# EAGLE design TinyGController (EAGLE 6.6.0)

## Sheet 1 of 3
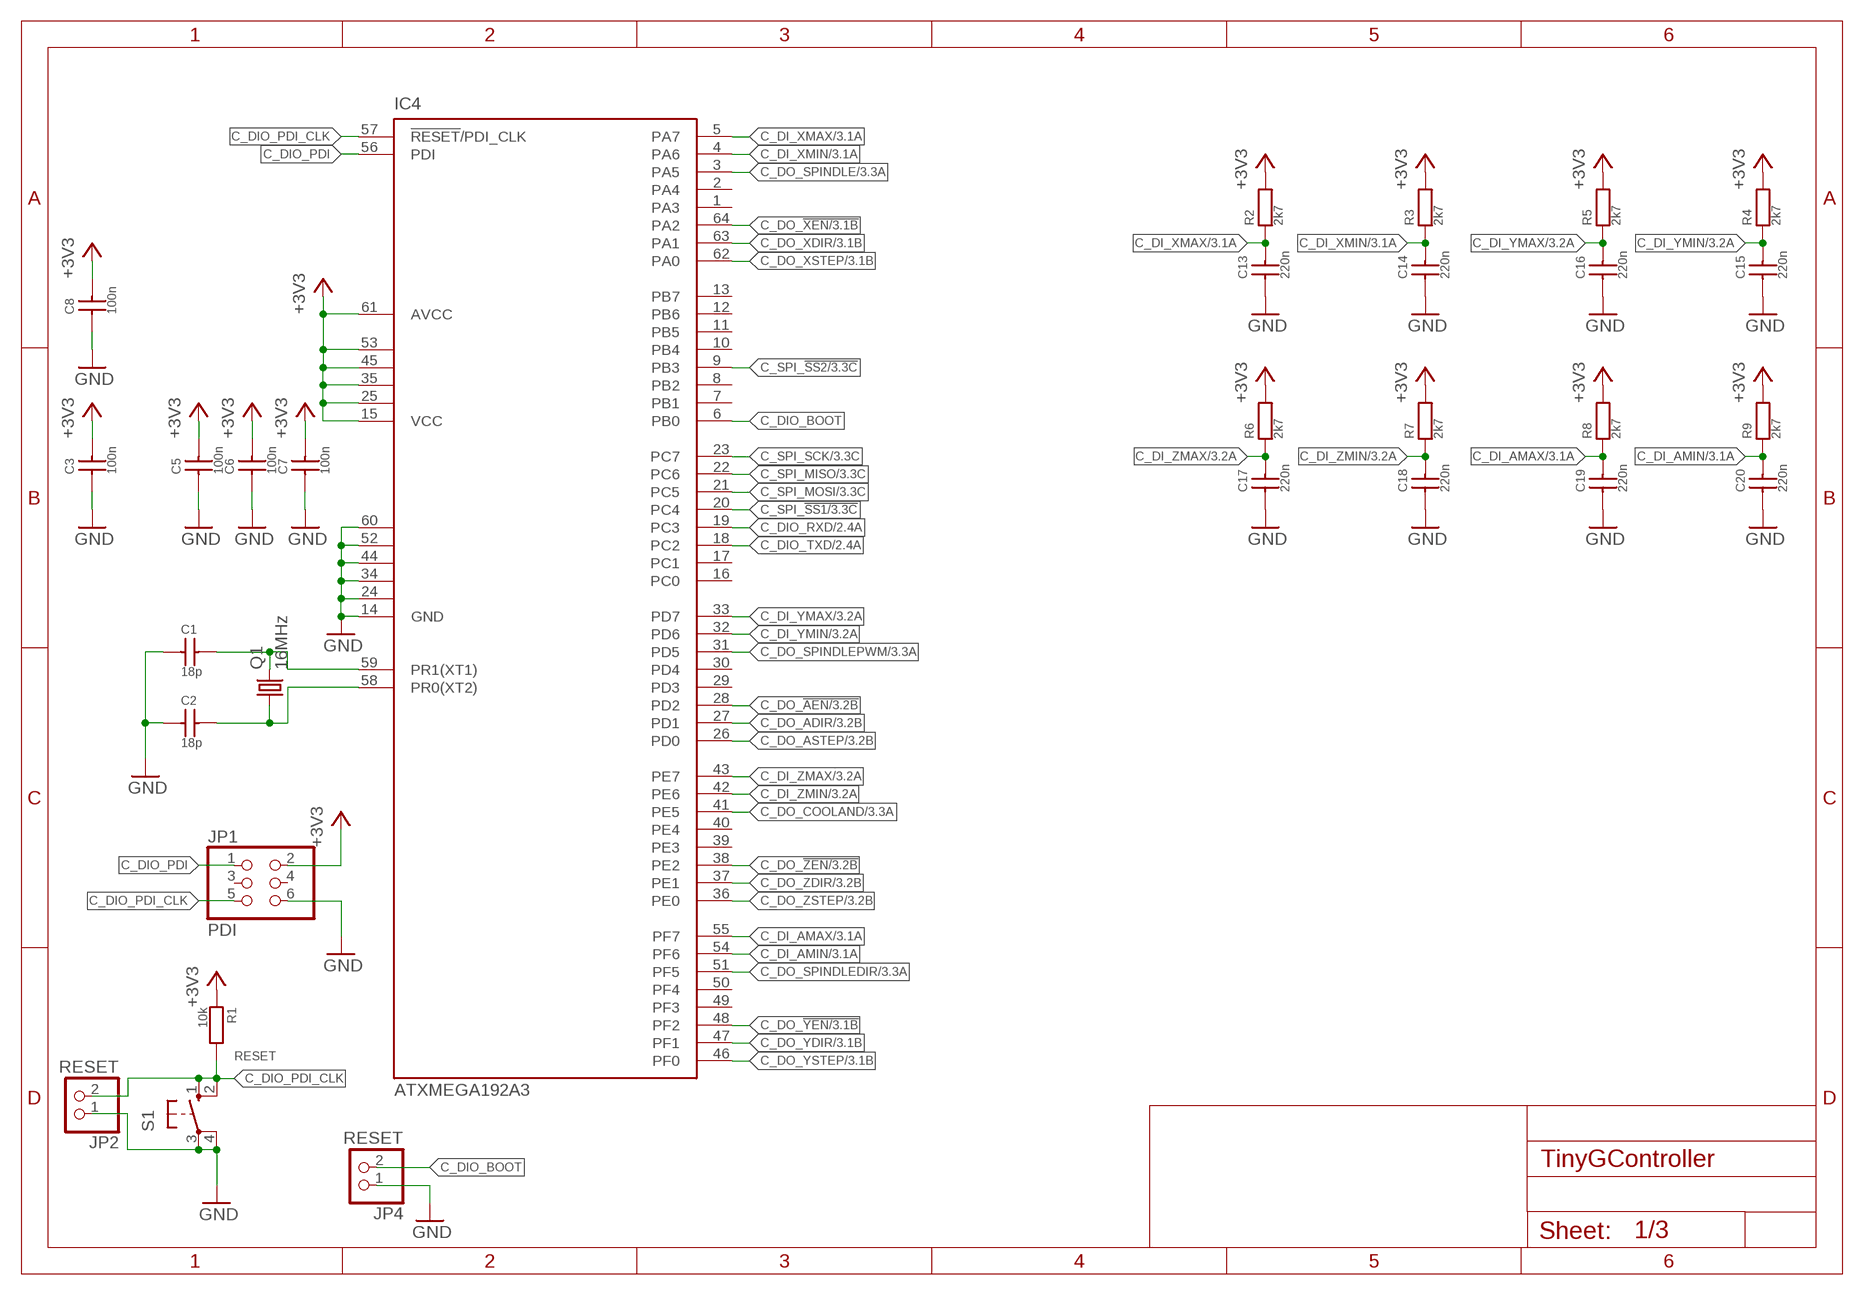
[diagram p0: schematic, sheet 1]

### Parts
C1  18p  C_SMD0603  [C0603]
C2  18p  C_SMD0603  [C0603]
C3  100n  C_SMD0603  [C0603]
C5  100n  C_SMD0603  [C0603]
C6  100n  C_SMD0603  [C0603]
C7  100n  C_SMD0603  [C0603]
C8  100n  C_SMD0603  [C0603]
C13  220n  C_SMD0805  [C0805]
C14  220n  C_SMD0805  [C0805]
C15  220n  C_SMD0805  [C0805]
C16  220n  C_SMD0805  [C0805]
C17  220n  C_SMD0805  [C0805]
C18  220n  C_SMD0805  [C0805]
C19  220n  C_SMD0805  [C0805]
C20  220n  C_SMD0805  [C0805]
IC4  ATXMEGA192A3  [TQFP64-0.8MM]
JP1  PDI  PINHD-2X3  [2X03]
JP2  RESET  PINHD-1X2  [1X02]
JP4  RESET  PINHD-1X2  [1X02]
Q1  16MHz  ATS073ASM-1  [HC49/USSM]
R1  10k  R0603  [R0603]
R2  2k7  R0603  [R0603]
R3  2k7  R0603  [R0603]
R4  2k7  R0603  [R0603]
R5  2k7  R0603  [R0603]
R6  2k7  R0603  [R0603]
R7  2k7  R0603  [R0603]
R8  2k7  R0603  [R0603]
R9  2k7  R0603  [R0603]
S1  10-XX  [B3F-10XX]

### Nets
+3V3: C3.2 C5.2 C6.2 C7.2 C8.2 IC4.15(VCC) IC4.25(VCC1) IC4.35(VCC2) IC4.45(VCC3) IC4.53(VCC4) IC4.61(AVCC) JP1.2 R1.1 R2.2 R3.2 R4.2 R5.2 R6.2 R7.2 R8.2 R9.2 ; also sheet 3
C_DI_AMAX: C19.2 IC4.55(PF7) R8.1 ; also sheet 3
C_DI_AMIN: C20.2 IC4.54(PF6) R9.1 ; also sheet 3
C_DI_XMAX: C13.2 IC4.5(PA7) R2.1 ; also sheet 3
C_DI_XMIN: C14.2 IC4.4(PA6) R3.1 ; also sheet 3
C_DI_YMAX: C16.2 IC4.33(PD7) R5.1 ; also sheet 3
C_DI_YMIN: C15.2 IC4.32(PD6) R4.1 ; also sheet 3
C_DI_ZMAX: C17.2 IC4.43(PE7) R6.1 ; also sheet 3
C_DI_ZMIN: C18.2 IC4.42(PE6) R7.1 ; also sheet 3
C_DIO_BOOT: IC4.6(PB0) JP4.2
C_DIO_PDI: IC4.56(PDI) JP1.1
C_DIO_PDI_CLK: IC4.57(!RESET!/PDI_CLK) JP1.5 JP2.2 R1.2 S1.1(S) S1.2(S1)
C_DIO_RXD: IC4.19(PC3) ; also sheet 2
C_DIO_TXD: IC4.18(PC2) ; also sheet 2
C_DO_!AEN: IC4.28(PD2) ; also sheet 3
C_DO_!XEN: IC4.64(PA2) ; also sheet 3
C_DO_!YEN: IC4.48(PF2) ; also sheet 3
C_DO_!ZEN: IC4.38(PE2) ; also sheet 3
C_DO_ADIR: IC4.27(PD1) ; also sheet 3
C_DO_ASTEP: IC4.26(PD0) ; also sheet 3
C_DO_COOLAND: IC4.41(PE5) ; also sheet 3
C_DO_SPINDLE: IC4.3(PA5) ; also sheet 3
C_DO_SPINDLEDIR: IC4.51(PF5) ; also sheet 3
C_DO_SPINDLEPWM: IC4.31(PD5) ; also sheet 3
C_DO_XDIR: IC4.63(PA1) ; also sheet 3
C_DO_XSTEP: IC4.62(PA0) ; also sheet 3
C_DO_YDIR: IC4.47(PF1) ; also sheet 3
C_DO_YSTEP: IC4.46(PF0) ; also sheet 3
C_DO_ZDIR: IC4.37(PE1) ; also sheet 3
C_DO_ZSTEP: IC4.36(PE0) ; also sheet 3
C_SPI_!SS1: IC4.20(PC4) ; also sheet 3
C_SPI_!SS2: IC4.9(PB3) ; also sheet 3
C_SPI_MISO: IC4.22(PC6) ; also sheet 3
C_SPI_MOSI: IC4.21(PC5) ; also sheet 3
C_SPI_SCK: IC4.23(PC7) ; also sheet 3
GND: C1.1 C2.1 C3.1 C5.1 C6.1 C7.1 C8.1 C13.1 C14.1 C15.1 C16.1 C17.1 C18.1 C19.1 C20.1 IC4.14(GND) IC4.24(GND1) IC4.34(GND2) IC4.44(GND3) IC4.52(GND4) IC4.60(GND5) JP1.6 JP2.1 JP4.1 S1.3(P) S1.4(P1) ; also sheet 2,3
N$1: C1.2 IC4.59(PR1(XT1)) Q1.2
N$2: C2.2 IC4.58(PR0(XT2)) Q1.1
Unconnected: IC4.1(PA3) IC4.2(PA4) IC4.7(PB1) IC4.8(PB2) IC4.10(PB4) IC4.11(PB5) IC4.12(PB6) IC4.13(PB7) IC4.16(PC0) IC4.17(PC1) IC4.29(PD3) IC4.30(PD4) IC4.39(PE3) IC4.40(PE4) IC4.49(PF3) IC4.50(PF4) JP1.3 JP1.4

### Notes on the sheet
- RESET

## Sheet 2 of 3
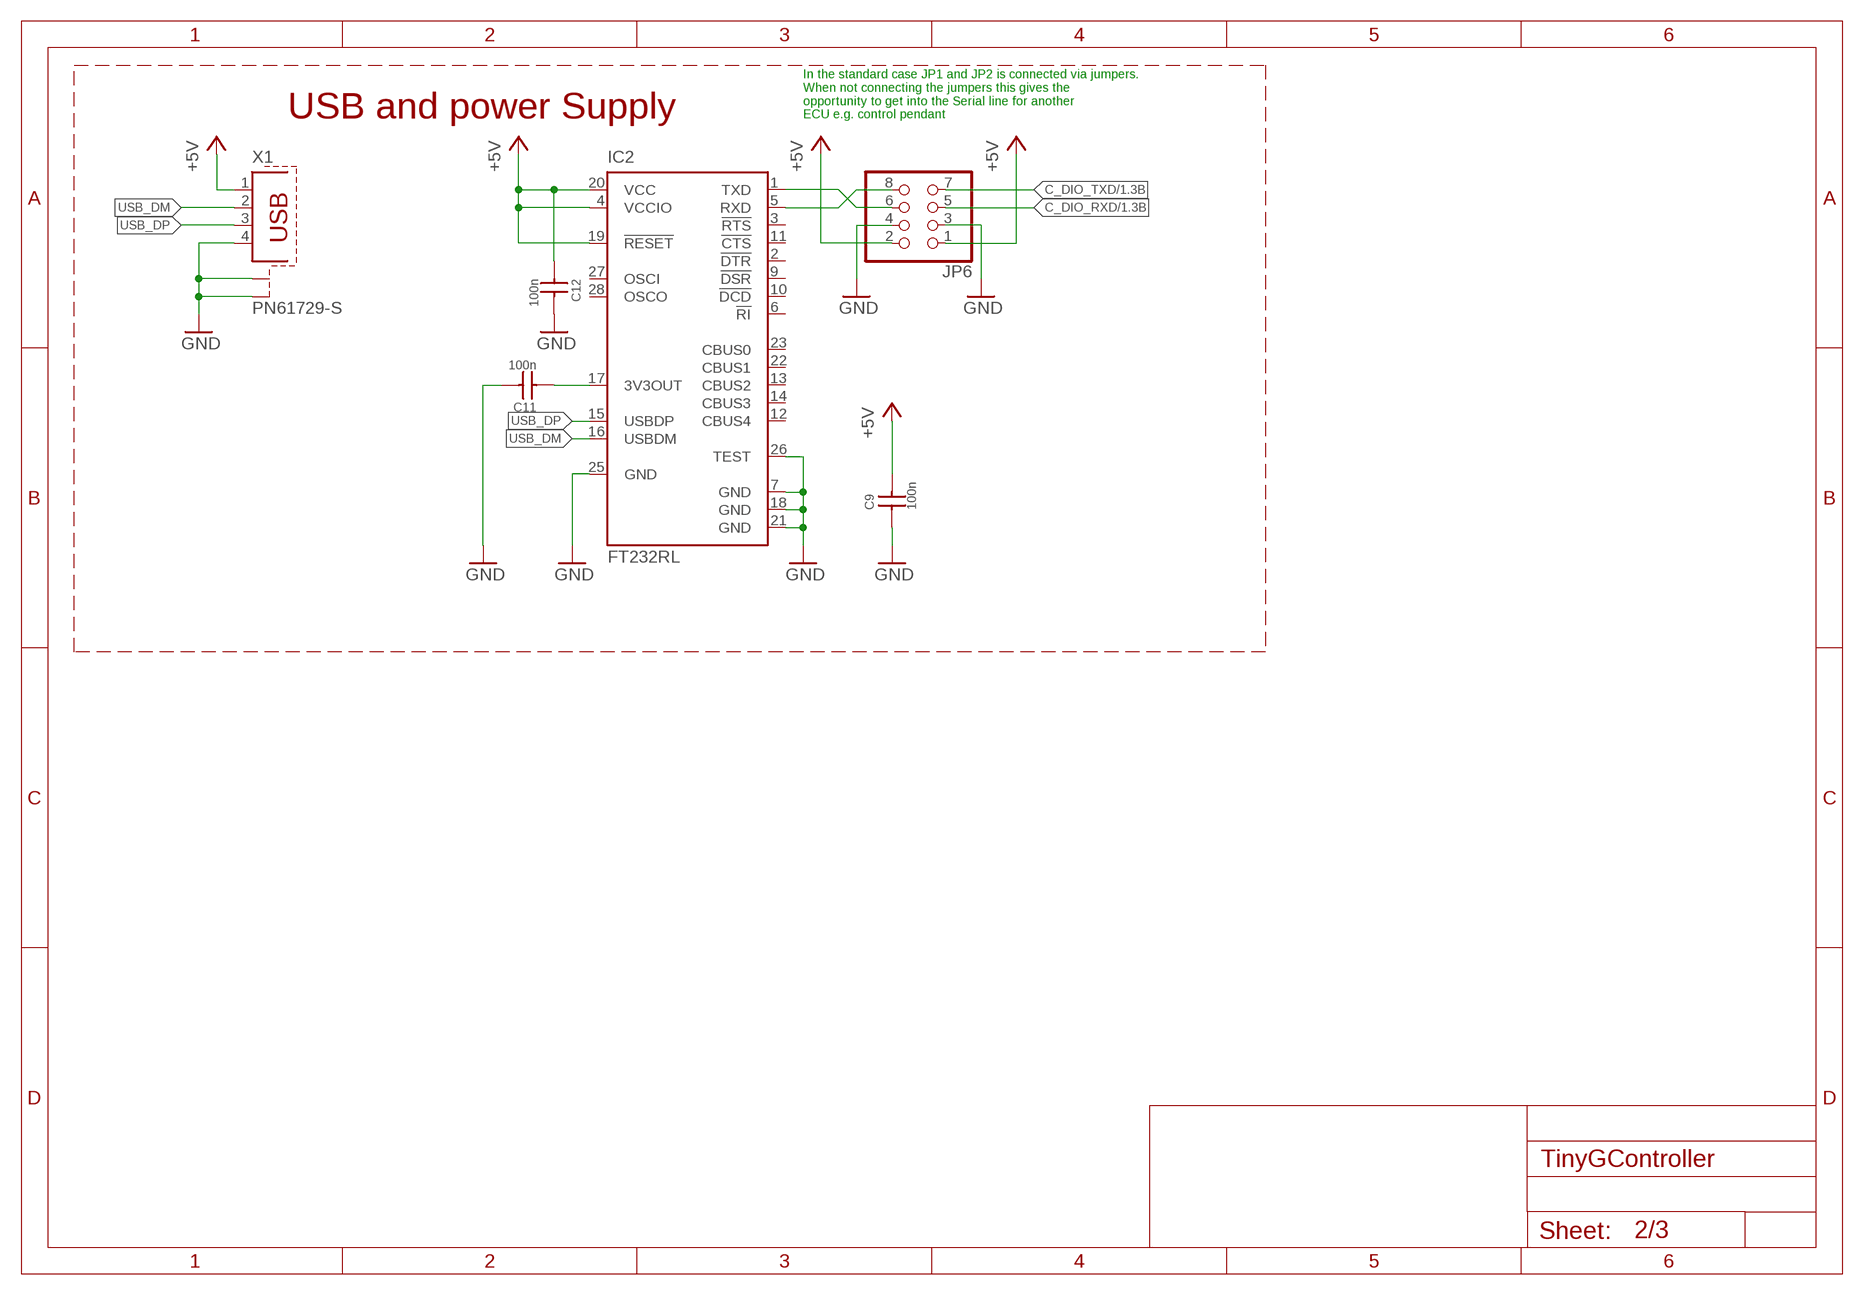
[diagram p1: schematic, sheet 2]

### Parts
C9  100n  C_SMD0603  [C0603]
C11  100n  C_SMD0603  [C0603]
C12  100n  C_SMD0603  [C0603]
IC2  FT232RL  [SSOP28]
JP6  PINHD-2X4  [2X04]
X1  PN61729-S  [PN61729-S]

### Nets
+5V: C9.2 C12.1 IC2.4(VCCIO) IC2.19(!RESET) IC2.20(VCC) JP6.1 JP6.2 X1.1
C_DIO_RXD: JP6.5 ; also sheet 1
C_DIO_TXD: JP6.7 ; also sheet 1
FTDI_3V3OUT: C11.1 IC2.17(3V3OUT)
GND: C9.1 C11.2 C12.2 IC2.7(GND) IC2.18(GND) IC2.21(GND) IC2.25(GND) IC2.26(TEST) JP6.3 JP6.4 X1.4 X1.S1 X1.S2 ; also sheet 1,3
N$5: IC2.1(TXD) JP6.6
N$7: IC2.5(RXD) JP6.8
USB_DM: IC2.16(USBDM) X1.2
USB_DP: IC2.15(USBDP) X1.3
Unconnected: IC2.2(!DTR) IC2.3(!RTS) IC2.6(!RI) IC2.9(!DSR) IC2.10(!DCD) IC2.11(!CTS) IC2.12(CBUS4) IC2.13(CBUS2) IC2.14(CBUS3) IC2.22(CBUS1) IC2.23(CBUS0) IC2.27(OSCI) IC2.28(OSCO)

### Notes on the sheet
- USB and power Supply
- In the standard case JP1 and JP2 is connected via jumpers.
  When not connecting the jumpers this gives the 
  opportunity to get into the Serial line for another 
  ECU e.g. control pendant

## Sheet 3 of 3
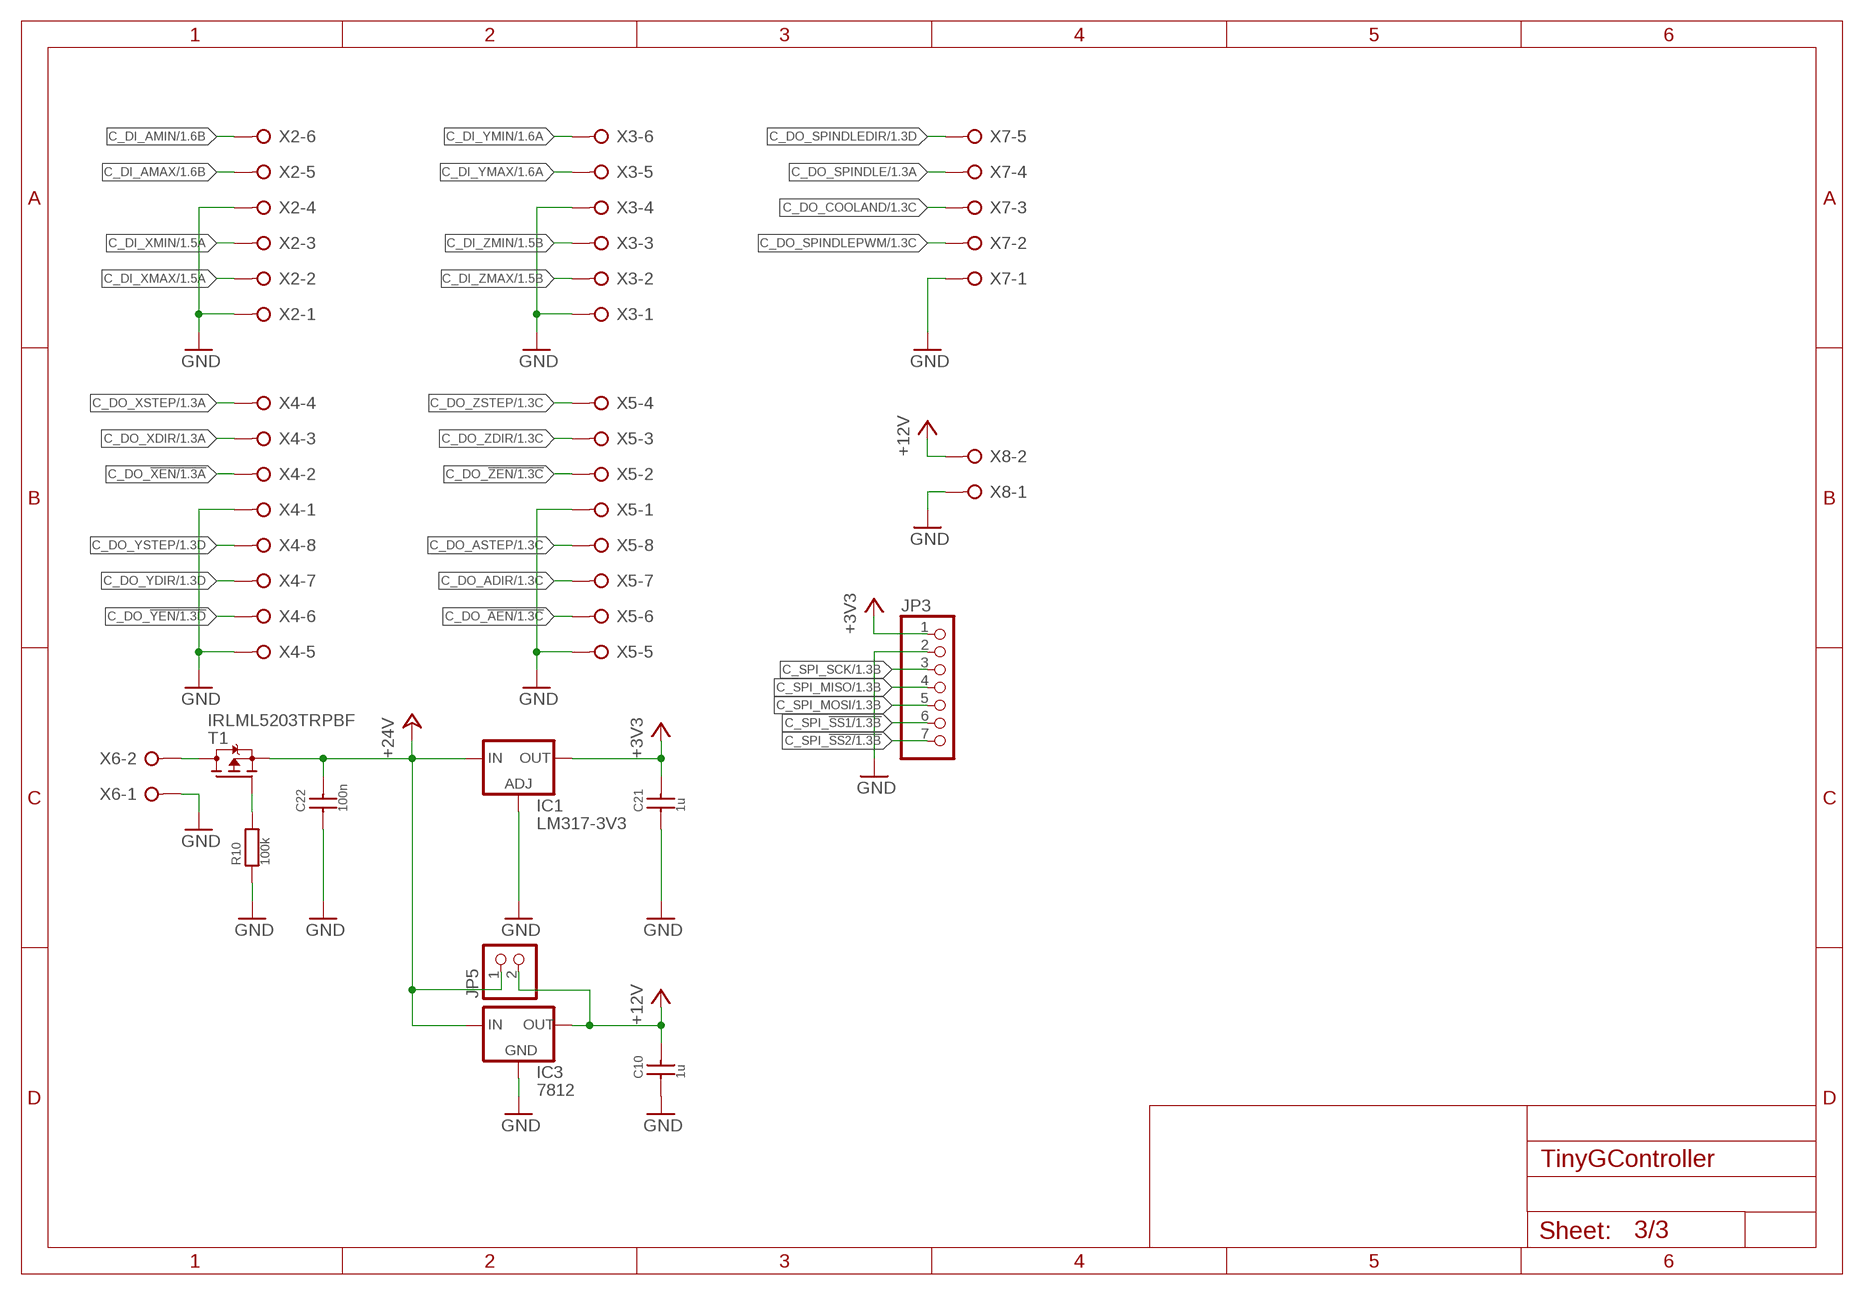
[diagram p2: schematic, sheet 3]

### Parts
C10  1u  C_SMD0805  [C0805]
C21  1u  C_SMD0805  [C0805]
C22  100n  C_SMD0805  [C0805]
IC1  LM317-3V3  LM317MBSTT3  [SOT223]
IC3  7812  78XXS  [78XXS]
JP3  PINHD-1X7  [1X07]
JP5  PINHD-1X2  [1X02]
R10  100k  R0603  [R0603]
T1  IRLML5203TRPBF  [SOT23]
X2  W237-06P  [W237-6P]
X3  W237-06P  [W237-6P]
X4  W237-08P  [W237-8P]
X5  W237-08P  [W237-8P]
X6  W237-02P  [W237-132]
X7  W237-05P  [W237-5P]
X8  W237-02P  [W237-132]

### Nets
+3V3: C21.2 IC1.4(OUT) JP3.1 ; also sheet 1
+12V: C10.2 IC3.OUT JP5.2 X8.2
+24V: C22.2 IC1.3(IN) IC3.IN JP5.1 T1.2(S)
C_DI_AMAX: X2.5 ; also sheet 1
C_DI_AMIN: X2.6 ; also sheet 1
C_DI_XMAX: X2.2 ; also sheet 1
C_DI_XMIN: X2.3 ; also sheet 1
C_DI_YMAX: X3.5 ; also sheet 1
C_DI_YMIN: X3.6 ; also sheet 1
C_DI_ZMAX: X3.2 ; also sheet 1
C_DI_ZMIN: X3.3 ; also sheet 1
C_DO_!AEN: X5.6 ; also sheet 1
C_DO_!XEN: X4.2 ; also sheet 1
C_DO_!YEN: X4.6 ; also sheet 1
C_DO_!ZEN: X5.2 ; also sheet 1
C_DO_ADIR: X5.7 ; also sheet 1
C_DO_ASTEP: X5.8 ; also sheet 1
C_DO_COOLAND: X7.3 ; also sheet 1
C_DO_SPINDLE: X7.4 ; also sheet 1
C_DO_SPINDLEDIR: X7.5 ; also sheet 1
C_DO_SPINDLEPWM: X7.2 ; also sheet 1
C_DO_XDIR: X4.3 ; also sheet 1
C_DO_XSTEP: X4.4 ; also sheet 1
C_DO_YDIR: X4.7 ; also sheet 1
C_DO_YSTEP: X4.8 ; also sheet 1
C_DO_ZDIR: X5.3 ; also sheet 1
C_DO_ZSTEP: X5.4 ; also sheet 1
C_SPI_!SS1: JP3.6 ; also sheet 1
C_SPI_!SS2: JP3.7 ; also sheet 1
C_SPI_MISO: JP3.4 ; also sheet 1
C_SPI_MOSI: JP3.5 ; also sheet 1
C_SPI_SCK: JP3.3 ; also sheet 1
GND: C10.1 C21.1 C22.1 IC1.1(ADJ) IC3.GND JP3.2 R10.1 X2.1 X2.4 X3.1 X3.4 X4.1 X4.5 X5.1 X5.5 X6.1 X7.1 X8.1 ; also sheet 1,2
N$3: R10.2 T1.1(G)
N$4: T1.3(D) X6.2

## Library data of the parts
C1-C3 C5-C22 = SchlegelAr_Master:C_SMD: C SMD 0402, 0603, 0805, 1206 last modified: Armin Schlegel, 24.03.2014
IC1 = v-reg:LM317?*: 500 mA Adjustable Output Positive Voltage Regulator Source: http://www.onsemi.co.jp .. LM317M-D.PDF
IC2 = SchlegelAr_Master:FT232RL: FT232RL - USB-IC-Schnittstelle USB to Serial UART Enhanced IC last modified: Armin Schlegel, 28.04.2014 http://de.mouser.com/ProductDetail/FTDI/FT232RL-REEL/?qs=sGAEpiMZZMs5ceO8zL%252bTxyQLQIH6hE7q http://www.mouser.com/ds/2/163/DS_FT232R-11534.pdf
IC3 = v-reg:78XXS: VOLTAGE REGULATOR
IC4 = SchlegelAr_Master:ATXMEGA192A3
JP1 = pinhead:PINHD-2X3: PIN HEADER
JP2 JP4 JP5 = pinhead:PINHD-1X2: PIN HEADER
JP3 = pinhead:PINHD-1X7: PIN HEADER
JP6 = pinhead:PINHD-2X4: PIN HEADER
Q1 = SchlegelAr_Master:ATS073ASM-1: ATS073ASM-1 - Quarze 7.3728MHz Series 30ppm -20C 70C last modified: Armin Schlegel, 21.03.2014 http://de.mouser.com/ProductDetail/CTS-Electronic-Components/ATS073ASM-1/?qs=sGAEpiMZZMsBj6bBr9Q9aSLORZG%2fS%2fcqT3YYbKWRivQ%3d http://www.mouser.com/ds/2/96/008-0309-0-32667.pdf
R1-R10 = SchlegelAr_Master:R: Widerstaende in 0402, 0603, 0805, 1206, 2512 last modified: Armin Schlegel, 28.04.2014
S1 = switch-omron:10-XX: OMRON SWITCH; MPN: B3F-1000; OC_FARNELL: 176432; OC_NEWARK: 36M3542
T1 = SchlegelAr_Master:IRLML5203TRPBF: IRLML5203TRPBF - MOSFET MOSFT P-Ch -30V -3A 98mOhm 9.5nC Log Lvl last modified: Armin Schlegel, 28.04.2014 http://de.mouser.com/ProductDetail/International-Rectifier/IRLML5203TRPBF/?qs=sGAEpiMZZMshyDBzk1%2fWi5%252bqVgN3%252bWS8t7qb9msI9Rk%3d http://www.mouser.com/ds/2/200/irlml5203pbf-223113.pdf
X1 = con-berg:PN61729-S: BERG USB connector; OC_FARNELL: unknown; OC_NEWARK: unknown
X2 X3 = con-wago-508:W237-06P: WAGO SREW CLAMP; OC_FARNELL: unknown; OC_NEWARK: unknown
X4 X5 = con-wago-508:W237-08P: WAGO SREW CLAMP; OC_FARNELL: unknown; OC_NEWARK: unknown
X6 X8 = con-wago-508:W237-02P: WAGO SREW CLAMP; OC_FARNELL: unknown; OC_NEWARK: unknown
X7 = con-wago-508:W237-05P: WAGO SREW CLAMP; OC_FARNELL: unknown; OC_NEWARK: unknown

## Board
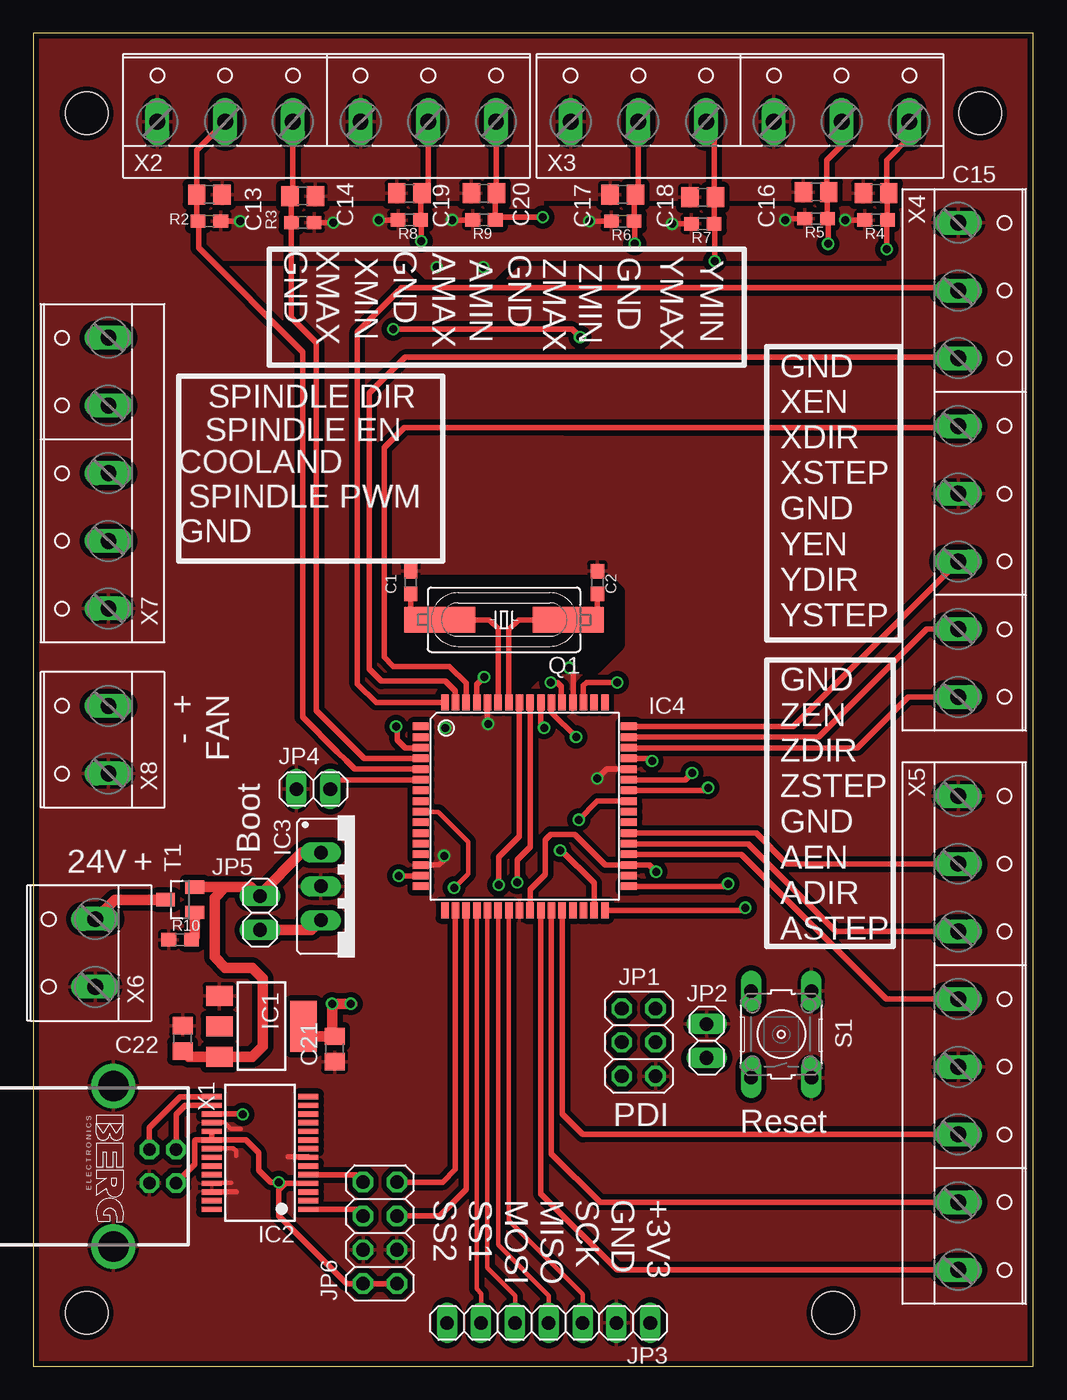
[diagram p3: board, top side]
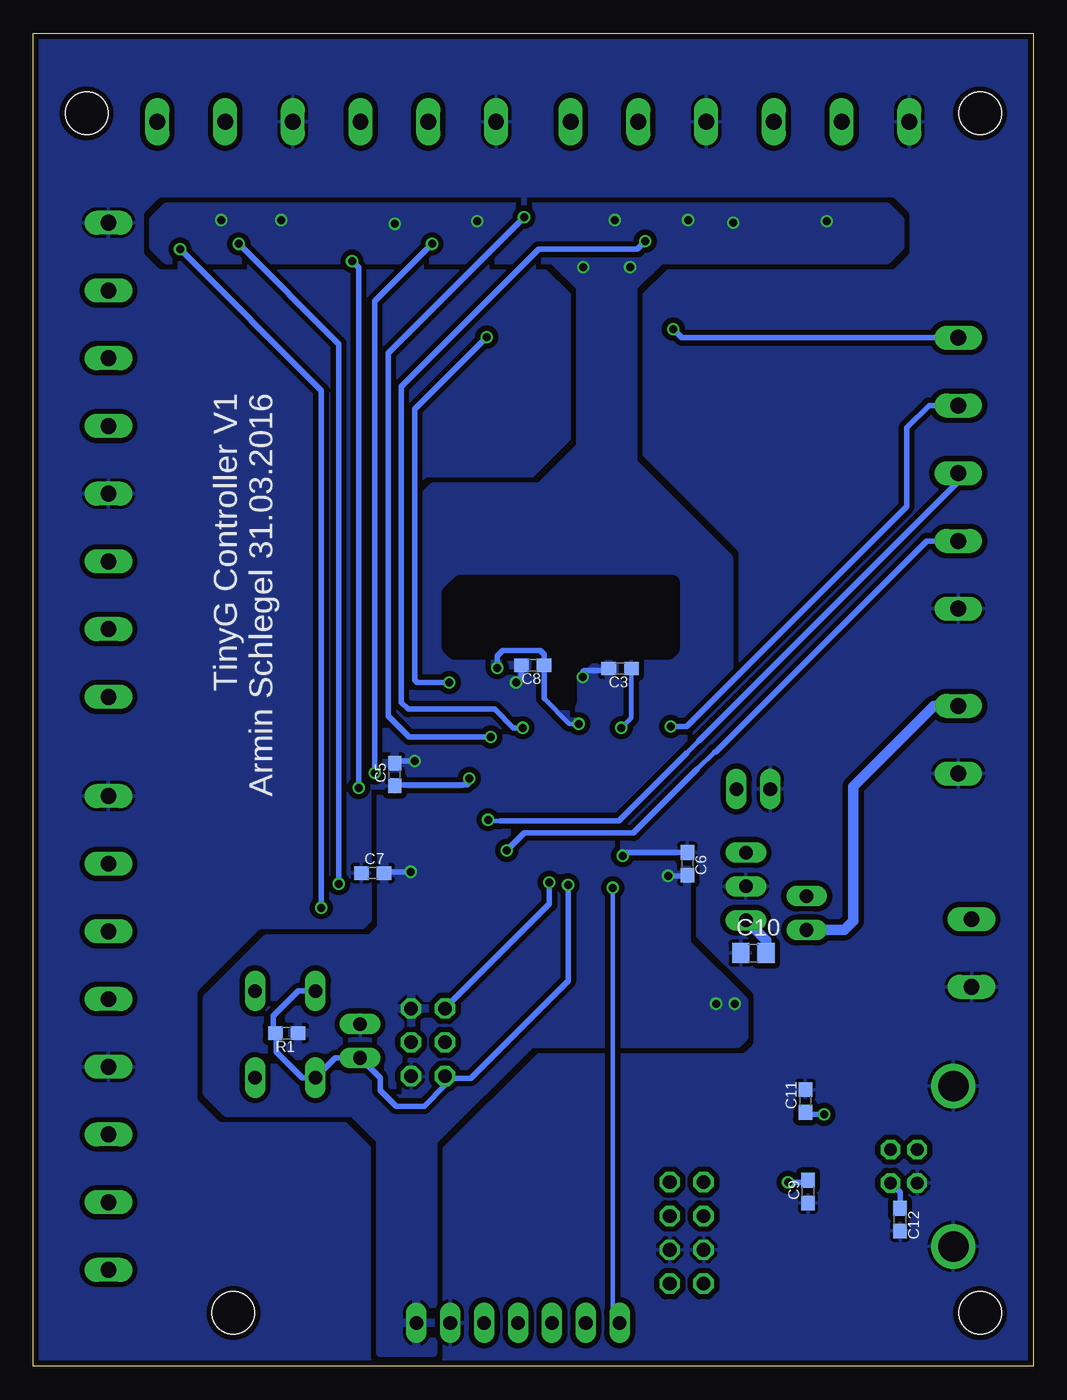
[diagram p4: board, bottom side, seen from below]

Size 75 x 100 mm. Coordinates in mm from the lower left corner, seen from the top.
Outline: 0,0 75,0 75,100 0,100 0,0
Copper layers (1*16): Top 0.035mm / dielectric 1.5mm / Bottom 0.035mm
Design rules "Elecrow_2-layer_eagle_rule": minimum track width 6mil, minimum drill 12mil, track to track 6mil, track to pad 6mil, pad to pad 6mil, via to via 6mil, smd to smd 0mil, copper to edge 10mil, drill to drill 10mil, minimum pad ring 10mil, minimum via ring 6mil, stop-mask expansion 2mil, vias tented up to drill 100mil, thermal gap 10mil
Holes 3.2 mm at 4,94 71,94 4,4 60,4
tRestrict: area 27.1,50.8 to 43.8,58.8
bRestrict: area 27.1,49.8 to 43.8,58.8

### Footprints (pad centres in the part's own frame; a part is rotated, then mirrored left to right if it is on the bottom)
C0603 = smd 1.1 x 1: 1 -0.85,0; 2 0.85,0
C0805 = smd 1.3 x 1.5: 1 -0.95,0; 2 0.95,0
SOT223 = smd 1.5 x 2: 1 -2.3,-3.15; 2 0,-3.15; 3 2.3,-3.15 | smd 3.8 x 2: 4 0,3.15
SSOP28 = smd 0.4 x 1.5: 1 -4.225,-3.625; 2 -3.575,-3.625; 3 -2.925,-3.625; 4 -2.275,-3.625; 5 -1.625,-3.625; 6 -0.975,-3.625; 7 -0.325,-3.625; 8 0.325,-3.625; 9 0.975,-3.625; 10 1.625,-3.625; 11 2.275,-3.625; 12 2.925,-3.625; 13 3.575,-3.625; 14 4.225,-3.625; 15 4.225,3.625; 16 3.575,3.625; 17 2.925,3.625; 18 2.275,3.625; 19 1.625,3.625; 20 0.975,3.625; 21 0.325,3.625; 22 -0.325,3.625; 23 -0.975,3.625; 24 -1.625,3.625; 25 -2.275,3.625; 26 -2.925,3.625; 27 -3.575,3.625; 28 -4.225,3.625
78XXS = drill 1.016 long: GND 0,-2.54; IN -2.54,-2.54; OUT 2.54,-2.54
TQFP64-0.8MM = smd 1.194 x 0.559: 1 -7.94,6; 2 -7.94,5.2; 3 -7.94,4.4; 4 -7.94,3.6; 5 -7.94,2.8; 6 -7.94,2; 7 -7.94,1.2; 8 -7.94,0.4; 9 -7.94,-0.4; 10 -7.94,-1.2; 11 -7.94,-2; 12 -7.94,-2.8; 13 -7.94,-3.6; 14 -7.94,-4.4; 15 -7.94,-5.2; 16 -7.94,-6; 33 7.66,-6; 34 7.66,-5.2; 35 7.66,-4.4; 36 7.66,-3.6; 37 7.66,-2.8; 38 7.66,-2; 39 7.66,-1.2; 40 7.66,-0.4; 41 7.66,0.4; 42 7.66,1.2; 43 7.66,2; 44 7.66,2.8; 45 7.66,3.6; 46 7.66,4.4; 47 7.66,5.2; 48 7.66,6 | smd 0.559 x 1.194: 17 -6.14,-7.8; 18 -5.34,-7.8; 19 -4.54,-7.8; 20 -3.74,-7.8; 21 -2.94,-7.8; 22 -2.14,-7.8; 23 -1.34,-7.8; 24 -0.54,-7.8; 25 0.26,-7.8; 26 1.06,-7.8; 27 1.86,-7.8; 28 2.66,-7.8; 29 3.46,-7.8; 30 4.26,-7.8; 31 5.06,-7.8; 32 5.86,-7.8; 49 5.86,7.8; 50 5.06,7.8; 51 4.26,7.8; 52 3.46,7.8; 53 2.66,7.8; 54 1.86,7.8; 55 1.06,7.8; 56 0.26,7.8; 57 -0.54,7.8; 58 -1.34,7.8; 59 -2.14,7.8; 60 -2.94,7.8; 61 -3.74,7.8; 62 -4.54,7.8; 63 -5.34,7.8; 64 -6.14,7.8
2X03 = drill 1.016 octagon: 1 -2.54,-1.27; 2 -2.54,1.27; 3 0,-1.27; 4 0,1.27; 5 2.54,-1.27; 6 2.54,1.27
1X02 = drill 1.016 long: 1 -1.27,0; 2 1.27,0
1X07 = drill 1.016 long: 1 -7.62,0; 2 -5.08,0; 3 -2.54,0; 4 0,0; 5 2.54,0; 6 5.08,0; 7 7.62,0
2X04 = drill 1.016 octagon: 1 -3.81,-1.27; 2 -3.81,1.27; 3 -1.27,-1.27; 4 -1.27,1.27; 5 1.27,-1.27; 6 1.27,1.27; 7 3.81,-1.27; 8 3.81,1.27
HC49/USSM = smd 5.334 x 1.93: 1 -4.826,0; 2 4.826,0
R0603 = smd 1.1 x 1: 1 -0.85,0; 2 0.85,0
B3F-10XX = drill 1.016 long: 1 -3.251,2.261; 2 3.251,2.261; 3 -3.251,-2.261; 4 3.251,-2.261
SOT23 = smd 1 x 1.4: 1 -0.95,-1.1; 2 0.95,-1.1; 3 0,1.1
PN61729-S = drill 0.95 octagon: 1 1.25,4.71; 2 -1.25,4.71; 3 -1.25,2.71; 4 1.25,2.71 | drill 2.3 pad 2.9: S1 -6.02,0; S2 6.02,0
W237-6P = drill 1.194 long: 1 -12.7,-0.635; 2 -7.62,-0.635; 3 -2.54,-0.635; 4 2.54,-0.635; 5 7.62,-0.635; 6 12.7,-0.635
W237-8P = drill 1.194 long: 1 -17.78,-0.635; 2 -12.7,-0.635; 3 -7.62,-0.635; 4 -2.54,-0.635; 5 2.54,-0.635; 6 7.62,-0.635; 7 12.7,-0.635; 8 17.78,-0.635
W237-132 = drill 1.194 long: 1 -2.54,-0.635; 2 2.54,-0.635
W237-5P = drill 1.194 long: 1 -10.16,-0.635; 2 -5.08,-0.635; 3 0,-0.635; 4 5.08,-0.635; 5 10.16,-0.635

### Placement (x,y rotation side)
C1  28.3,58.8 270 top
C2  42.3,58.8 270 top
C3  31,52.35 180 bottom
C5  47.9,44.4 90 bottom
C6  25.95,37.7 270 bottom
C7  49.55,37 0 bottom
C8  37.55,52.6 180 bottom
C9  16.9,13.1 90 bottom
C10  21,31 0 bottom
C11  17.1,19.9 90 bottom
C12  10,11 270 bottom
C13  13.2,87.9 180 top
C14  20.2,87.8 180 top
C15  63.2,88 0 top
C16  58.7,88.1 0 top
C17  44.2,87.9 0 top
C18  50.2,87.7 0 top
C19  28.2,88 0 top
C20  33.8,88 0 top
C21  22.6,23.8 90 top
C22  11.2,24.6 270 top
IC1  17.1,25.5 270 top
IC2  17,16 90 top
IC3  24.1,36 270 top
IC4  37,42 0 top
JP1  45.4,24.3 270 top
JP2  50.5,24.4 270 top
JP3  38.65,3.25 180 top
JP4  21,43.3 0 top
JP5  17,34 270 top
JP6  26,10 90 top
Q1  35.3,56 180 top
R1  56,25 180 bottom
R2  13.2,85.9 0 top
R3  20.2,85.8 0 top
R4  63.2,86 180 top
R5  58.7,86.1 180 top
R6  44.2,85.9 180 top
R7  50.2,85.7 180 top
R8  28.2,86 180 top
R9  33.8,86 180 top
R10  11,32 0 top
S1  56.1,24.9 90 top
T1  11,35 90 top
X1  6,15 270 top
X2  22,94 0 top
X3  53,94 0 top
X4  70,68 270 top
X5  70,25 270 top
X6  4,31 90 top
X7  5,67 90 top
X8  5,47 90 top

### Tracks (layer width: path | path; a pad name or v marks a point on that pad's centre or on a via)
+3V3  (via drill 0.6)
  Top 0.4: IC4.53 39.6,49.86 39.6,51 39.3,51.3 v38.8,51.3 | 43,37.6 42.9,37.6 40.6,39.9 38.8,39.9 38.4,39.5 38.4,36.9 37.26,35.76
  Top 0.406: IC4.15 v27.4,36.8 | v46.7,37.1 46.2,37.6 IC4.35 43,37.6 | IC4.45 46.2,45.6 v46.4,45.4 | IC4.61 33.26,51.16 v33.8,51.7 | IC4.25 37.26,35.76 | R6.2 v41.7,85.9 | R2.2 v15.5,85.9 | R3.2 v22.5,85.8 | R8.2 v25.9,86 | R9.2 v31.4,86 | R7.2 v47.9,85.7 | R5.2 56.5,86.1 v56.4,86 | R4.2 v60.9,86
  Top 0.8: IC1.4 21,24.75 C21.2 22.4,24.95 v22.4,27.2 23.9,27.2
  Bottom 0.4: v38.8,51.3 38.4,51.7 C8.2
  Bottom 0.406: v27.4,36.8 26,36.8 C6.2 | v46.7,37.1 48.6,37.1 C7.2 | v46.4,45.4 47.75,45.4 C5.2 | v33.8,51.7 33.8,52.1 33.7,52.2 32,52.2 C3.2
  other vias: 33.75,82.45 30.25,82.45 23.8,27.2
  pour Bottom (isolate 0.406): 22.2,24.2 37.7,24.2 45,16.9 45,1 49,1 49,17 51,19 60.5,19 62,20.5 62,27.6 57.5,32.1 49.7,32.1 48.9,32.9 49,55 49,62 45,66 37,66 34,69 34,81 36,83 65,83 66,84 66,86 65,87 11,87 10,86 10,84 11,83 28,83 30,81 30,67.8 22.8,60.6 22.8,47.3 26,44.1 26,31.7 21.7,27.4 21.7,24.7
  pour Top (isolate 0.406): 11,87 65,87 66,86 66,84 65,83 36,83 34,81 30,81 28,83 11,83 10,84 10,86
+5V  (via drill 0.6)
  Top 0.4: IC2.19 IC2.20 | IC2.20 12.18,16.98 12.1,16.9 12.1,15.14 X1.1 | IC2.20 15.93,16.98 16.9,16 16.9,14.7 17.8,13.8 v18.4,13.8 18.48,13.72 18.9,13.72 | IC2.4 18.9,13.72 | 18.9,13.72 18.4,13.22 18.4,11.3 23.51,6.19 JP6.2 JP6.1
  Bottom 0.4: C12.1 10,13.04 X1.1 | v18.4,13.8 17.05,13.8 C9.2
+12V
  Top 0.8: IC3.OUT 20.83,32.73 JP5.2
  Bottom 0.8: 5.67,49.5 X8.2 7.46,49.54 13.5,43.5 13.5,33.4 14.17,32.73 JP5.2 | C10.2 20.05,31.95 IC3.OUT
+24V
  Top 0.8: T1.2 14.4,35.95 | 14.4,35.95 13.6,35.15 13.6,30.7 14.4,29.9 16.4,29.9 17.2,29.1 17.2,24 16.4,23.2 IC1.3 11.65,23.2 C22.2 | 14.4,35.95 16.32,35.95 JP5.1 17,35.4 20.14,38.54 IC3.IN
C_DI_AMAX  (via drill 0.6)
  Top 0.4: X2.5 29.62,88.47 C19.2 | 29.05,87.9 R8.1 29.1,85.95 v29.1,84.4 | IC4.55 38.06,48.14 v38.3,47.9
  Top 0.6: 29.27,88.12 C19.2 29.05,87.9
  Bottom 0.4: v38.3,47.9 39,47.9 40.4,49.3 46.9,49.3 47.4,49.8 47.4,73.5 37.1,83.8 29.7,83.8 v29.1,84.4
C_DI_AMIN  (via drill 0.6)
  Top 0.4: X2.6 34.7,88.05 C20.2 | 34.65,87.9 R9.1 34.85,86.2 v38.2,86.2 | 40.5,47.4 v40.7,47.2 38.86,49.04 IC4.54
  Top 0.6: 34.79,88.04 C20.2 34.65,87.9
  Bottom 0.4: v38.2,86.2 48.4,76 48.4,48.8 46.8,47.2 v40.7,47.2
C_DI_XMAX
  Top 0.4: X2.2 12.25,91.23 C13.2 12.25,86 R2.1 12.4,85.85 12.4,83.9 20.2,76.1 20.2,48.7 22.8,46.1 23.45,45.45 24.1,44.8 IC4.5
C_DI_XMIN
  Top 0.4: X2.3 19.46,88.01 C14.2 19.35,87.7 R3.1 19.35,78.65 21.2,76.8 21.2,49.2 24.8,45.6 IC4.4
C_DI_YMAX  (via drill 0.6)
  Top 0.4: X3.5 60.62,91.62 59.5,90.5 59.5,88.25 C16.2 59.55,88 R5.1 59.6,86.05 v59.6,84.2 | IC4.33 51.9,36 v52.1,36.2
  Top 0.6: 59.67,88.12 C16.2
  Bottom 0.4: v52.1,36.2 52.1,76.7 v59.6,84.2
C_DI_YMIN  (via drill 0.6)
  Top 0.4: X3.6 65.7,92.2 64,90.5 64,88.15 C15.2 64.05,87.9 R4.1 64,85.95 v64,83.8 | IC4.32 53.2,34.2 v53.4,34.4
  Top 0.6: 64.19,88.04 C15.2
  Bottom 0.4: v53.4,34.4 53.4,73.2 v64,83.8
C_DI_ZMAX  (via drill 0.6)
  Top 0.4: X3.2 45.38,88.13 C17.2 | 45.05,87.8 R6.1 45.1,85.85 v45.1,84.2 | IC4.43 48.9,44 v49.4,44.5
  Top 0.6: 45.17,87.88 C17.2 45.05,87.8
  Bottom 0.4: v49.4,44.5 49.4,79.9 v45.1,84.2
C_DI_ZMIN  (via drill 0.6)
  Top 0.4: X3.3 51.05,92.78 51.05,87.6 R7.1 51.1,85.65 v51.1,82.9 | IC4.42 50.4,43.2 v50.6,43.4
  Top 0.6: 51.05,87.6 C18.2
  Bottom 0.4: v50.6,43.4 50.6,82.4 v51.1,82.9
C_DIO_BOOT
  Top 0.4: IC4.6 22.97,44 JP4.2
C_DIO_PDI  (via drill 0.6)
  Top 0.4: IC4.56 37.26,38.96 36.3,38 v36.3,36.3
  Bottom 0.4: JP1.1 36.3,34.67 v36.3,36.3
C_DIO_PDI_CLK  (via drill 0.6)
  Top 0.4: IC4.57 36.46,39.76 34.9,38.2 v34.9,36.1
  Bottom 0.4: S1.2 55.15,28.15 57,26.3 57,25.15 R1.2 56.8,24.95 56.8,23.6 54.85,21.65 S1.1 52.36,23.13 JP2.2 49,21.63 49,20.7 47.8,19.5 45.7,19.5 44.13,21.07 JP1.5 43.97,21.6 42.2,21.6 34.9,28.9 v34.9,36.1
C_DIO_RXD
  Top 0.4: IC4.19 32.46,13.26 30.47,11.27 JP6.5
C_DIO_TXD
  Top 0.4: IC4.18 31.66,14.76 30.71,13.81 JP6.7
C_DO_!AEN
  Top 0.4: IC4.28 39.66,18.94 41.22,17.38 X5.6
C_DO_!XEN
  Top 0.4: IC4.64 25.7,49.8 24.3,51.2 24.3,77.6 27.25,80.55 27.4,80.7 27.6,80.9 35.6,80.9
  Top 0.406: 35.6,80.9 69.17,80.9 X4.2
C_DO_!YEN
  Top 0.4: IC4.48 56.98,48 X4.6
C_DO_!ZEN
  Top 0.4: IC4.38 54.2,40 56.5,37.7 X5.2
C_DO_ADIR
  Top 0.4: IC4.27 38.86,15.94 42.5,12.3 X5.7
C_DO_ASTEP
  Top 0.4: IC4.26 38.06,12.94 43.78,7.22 X5.8
C_DO_COOLAND  (via drill 0.6)
  Top 0.4: v40.9,41 42.3,42.4 IC4.41
  Bottom 0.35: 25.1,46.9 26,46 | 40,40.9 40.8,40.9 v40.9,41
  Bottom 0.4: 25.1,46.9 5.63,66.36 X7.3 | 26,46 31.1,40.9 40,40.9
C_DO_SPINDLE  (via drill 0.6)
  Top 0.4: IC4.3 27.9,46.4 27.3,47 27.3,47.9 v27.2,48
  Bottom 0.4: 5.71,72 X7.4 7.82,72.08 9.5,70.4 9.5,64.5 26,48 v27.2,48
C_DO_SPINDLEDIR  (via drill 0.6)
  Top 0.4: IC4.51 41.26,51.06 41.5,51.3 v43.8,51.3 | v41,77.2 40.4,77.8 v27,77.8
  Bottom 0.4: v43.8,51.3 46.2,51.3 46.4,51.5 46.4,71.8 v41,77.2 | v27,77.8 26.36,77.16 X7.5
C_DO_SPINDLEPWM  (via drill 0.6)
  Top 0.4: IC4.31 42.06,36.24 39.6,38.7 v39.5,38.7
  Bottom 0.35: 23.9,46.1 25.2,44.8
  Bottom 0.4: X7.2 8,61.92 23.82,46.1 23.9,46.1 | 25.2,44.8 30,40 38.2,40 v39.5,38.7
C_DO_XDIR
  Top 0.4: IC4.63 31.66,50.64 30.9,51.4 26.1,51.4 25.2,52.3 25.2,73 27.3,75.1 27.82,75.62 27.9,75.7 40.2,75.7
  Top 0.406: 40.2,75.7 69.28,75.7 X4.3
C_DO_XSTEP
  Top 0.4: IC4.62 32.46,51.24 31.2,52.5 27,52.5 26.3,53.2 26.3,68.9 27.8,70.4 39.9,70.4
  Top 0.406: 39.9,70.4 69.22,70.4 X4.4
C_DO_YDIR
  Top 0.4: IC4.47 58.9,47.2 67,55.3 X4.7
C_DO_YSTEP
  Top 0.4: IC4.46 61.8,46.4 65.6,50.2 69.34,50.2 X4.8
C_DO_ZDIR
  Top 0.4: IC4.37 53.6,39.2 60.2,32.6 60.22,32.62 X5.3
C_DO_ZSTEP
  Top 0.4: IC4.36 53.1,38.4 63.96,27.54 X5.4
C_SPI_!SS1
  Top 0.35: IC4.20 33.26,5.79 33.6,5.45 33.6,3.28 JP3.6
C_SPI_!SS2  (via drill 0.6)
  Top 0.35: IC4.9 30.35,41.6 32.6,39.35 32.6,36.95 v31.55,35.9
  Bottom 0.35: v31.55,35.9 31.55,3.77 JP3.7
C_SPI_MISO
  Top 0.35: IC4.22 34.86,9.09 38.65,5.3 JP3.4
C_SPI_MOSI
  Top 0.35: IC4.21 34.06,7.39 36.15,5.3 36.15,3.29 JP3.5
C_SPI_SCK
  Top 0.35: IC4.23 35.66,10.94 41.2,5.4 JP3.3
FTDI_3V3OUT  (via drill 0.6)
  Top 0.4: IC2.17 15.68,18.93 v15.7,18.9
  Bottom 0.4: v15.7,18.9 16.95,18.9 C11.1
GND  (via drill 0.6)
  Top 0.35: IC2.18 13.4,18.3 14.3,18.3 14.8,17.8 15.55,17.8 | IC2.21 13.4,16.35 15,16.35 15.2,16.15 15.2,15.8 | IC2.25 13.4,13.75 14.85,13.75
  Top 0.4: v30.9,47.9 31.2,47.9 | IC4.60 34.06,48.14 v34.1,48.2 | v42.3,44.1 43,44.8 IC4.44 | IC4.14 30.4,37.6 30.8,38 v30.8,38.3 | IC2.7 20.6,15.7 19.1,15.7 | IC2.26 13.4,13.1 15.2,13.1 | IC4.52 40.5,49.84 40.5,52 40.2,52.3 v40.2,52.4
  Bottom 0.35: v34.1,48.2 34.8,48.2 36.7,50.1 | C3.1 30.15,48.65 v30.9,47.9
  Bottom 0.4: 36.7,50.1 C8.1 36.7,53.4 37,53.7 39.8,53.7 40.2,53.3 v40.2,52.4 | C5.1 47.85,43.6 42.5,43.6 42.3,43.8 v42.3,44.1 | 26.2,38.3 C6.1 30.55,38.55 v30.8,38.3
  pour Bottom (isolate 0.406, rank 6): 0,100 75,100 75,0 0,0
  pour Top (isolate 0.406, rank 6): 0,100 75,100 75,0 0,0
N$1
  Top 0.4: IC4.59 34.86,55.34 34.2,56 Q1.2 29.97,56.5 28.5,56.5 28.3,56.7 C1.2
N$2
  Top 0.4: IC4.58 35.66,55.26 36.4,56 Q1.1 42.1,56 42.3,56.2 C2.2
N$3
  Top 0.8: T1.1 12.1,32.25 R10.2
N$4
  Top 0.8: T1.3 6.09,35 X6.2
N$5
  Top 0.4: IC2.1 24.23,11.78 JP6.6
N$7
  Top 0.4: IC2.5 24.16,14.38 JP6.8
USB_DM
  Top 0.4: IC2.16 11.38,19.57 10.7,18.9 X1.2
USB_DP
  Top 0.4: IC2.15 11.03,20.23 8.7,17.9 X1.3

### Text on the board
tNames: GND | GND | GND | GND | XMAX | XMIN | AMIN | ZMIN | YMIN | AMAX | ZMAX | YMAX | SPINDLE DIR | SPINDLE EN | COOLAND | SPINDLE PWM | GND | GND / XEN / XDIR / XSTEP / GND / YEN / YDIR / YSTEP | - + / FAN | Boot | 24V | + | GND / ZEN / ZDIR / ZSTEP / GND / AEN / ADIR / ASTEP | PDI | Reset | +3V3 / GND / SCK / MISO / MOSI / SS1 / SS2
bNames: TinyG Controller V1 / Armin Schlegel 31.03.2016